# EAGLE design GYROSCOPIO-UPDATE (EAGLE 9.5.1)
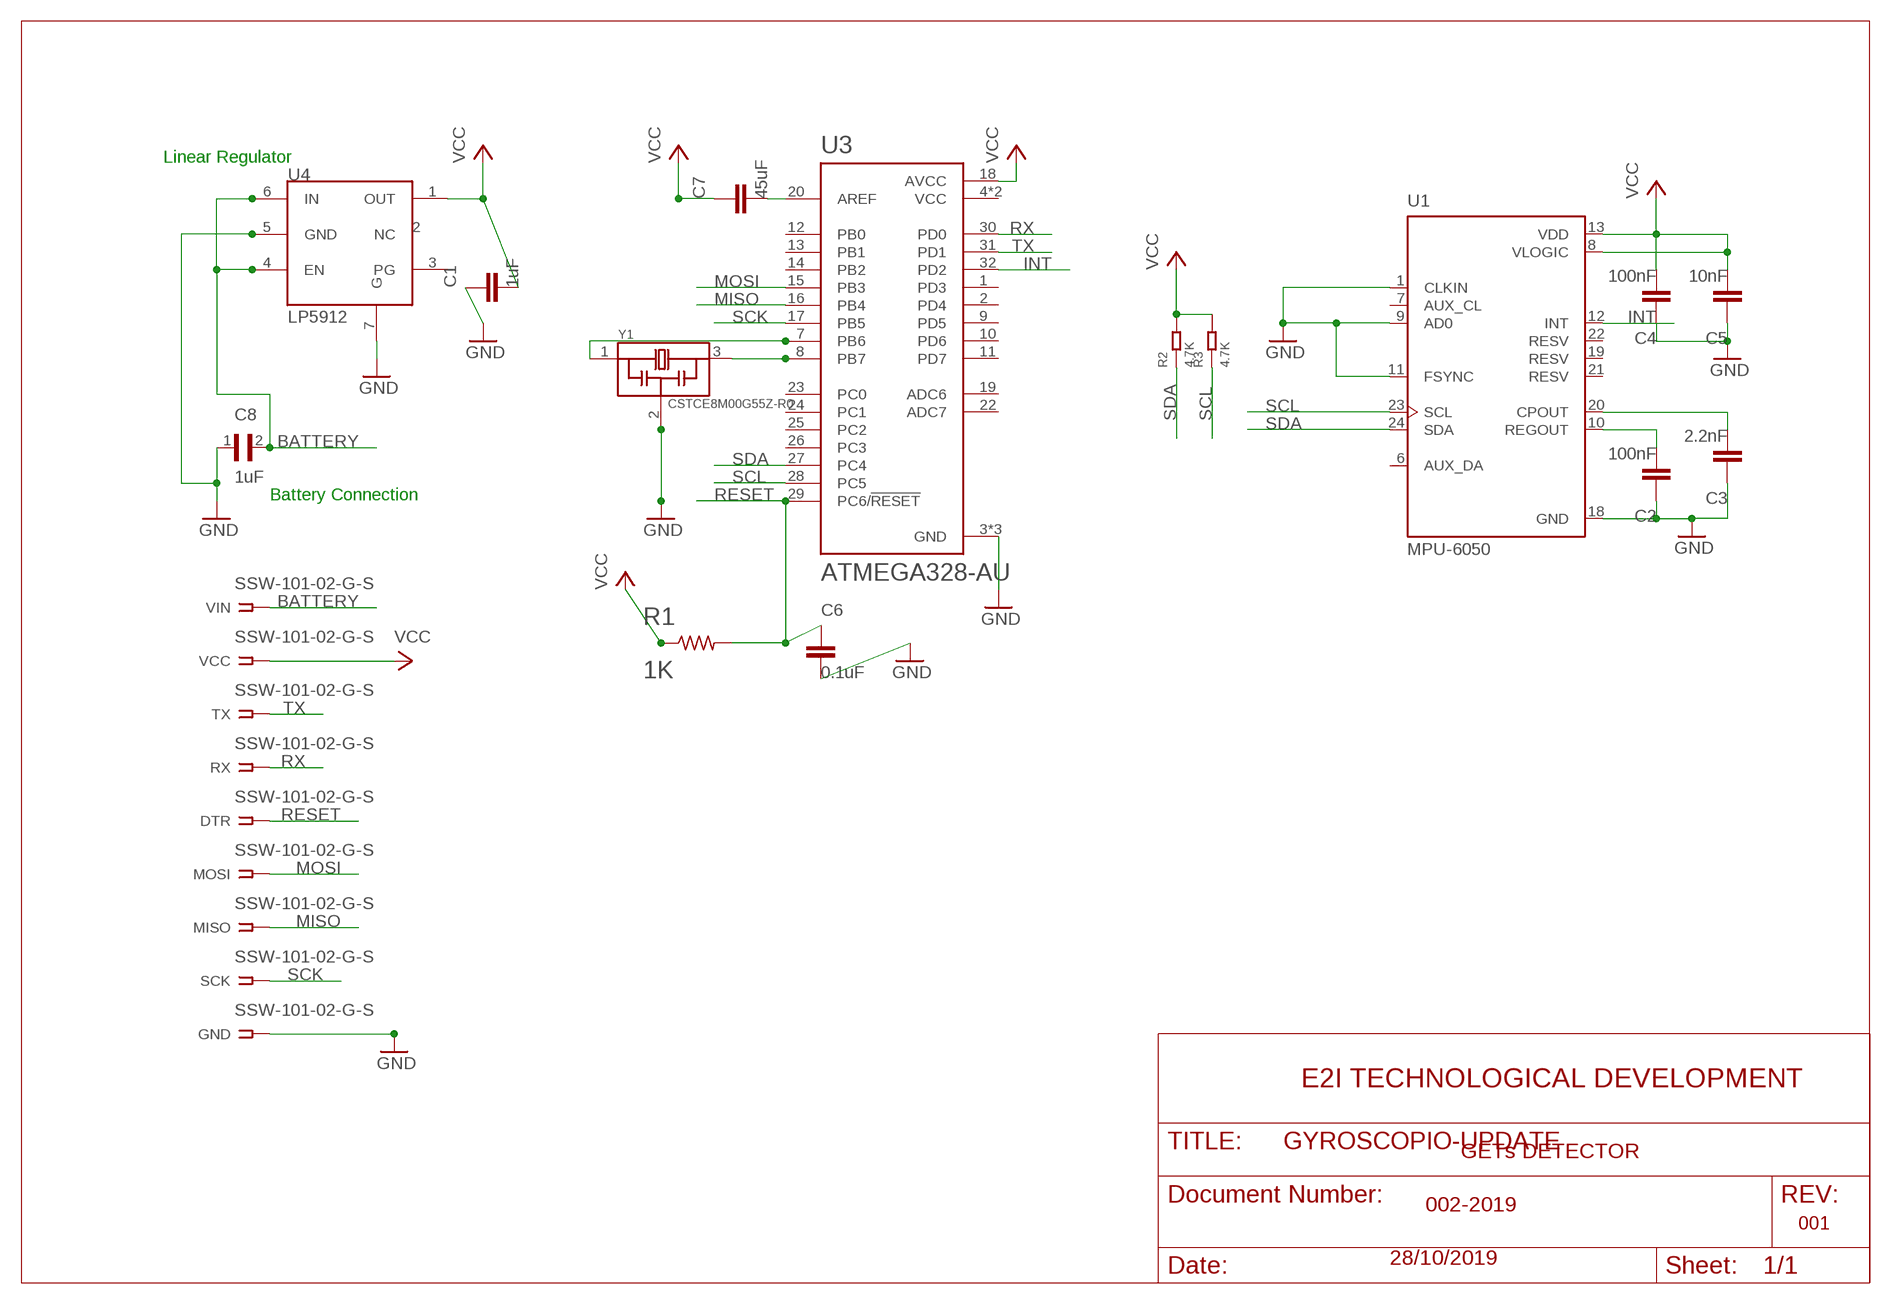
[diagram p0: schematic, sheet 1]

## Parts
C1  1uF  C-EUC0603  [C0603]
C2  100nF  C-EUC0603  [C0603]
C3  2.2nF  C-EUC0603  [C0603]
C4  100nF  C-EUC0603  [C0603]
C5  10nF  C-EUC0603  [C0603]
C6  0.1uF  C-EUC0603  [C0603]
C7  45uF  C-EUC0603  [C0603]
C8  1uF  0402YD105MAT2A  [CAPC1005X71N]
DTR  SSW-101-02-G-S  [SSW-101-02-G-S]
GND  SSW-101-02-G-S  [SSW-101-02-G-S]
MISO  SSW-101-02-G-S  [SSW-101-02-G-S]
MOSI  SSW-101-02-G-S  [SSW-101-02-G-S]
R1  1K  R-US_R0603  [R0603]
R2  4.7K  SMD-RES-4.7K-5%-1/16W(0402)  [R0402]
R3  4.7K  SMD-RES-4.7K-5%-1/16W(0402)  [R0402]
RX  SSW-101-02-G-S  [SSW-101-02-G-S]
SCK  SSW-101-02-G-S  [SSW-101-02-G-S]
TX  SSW-101-02-G-S  [SSW-101-02-G-S]
U1  MPU-6050  [QFN50P400X400X95-24N]
U3  ATMEGA328-AU  [QFP80P900X900X120-32N]
U4  LP5912  [LP5912]
VCC  SSW-101-02-G-S  [SSW-101-02-G-S]
VIN  SSW-101-02-G-S  [SSW-101-02-G-S]
Y1  CSTCE8M00G55Z-R0  CSTCE16M0V53-R0  [OSC_CSTCE16M0V53-R0]

## Nets
BATTERY: C8.2 U4.4(EN) U4.6(IN) VIN.1
GND: C1.1 C2.1 C3.1 C4.1 C5.1 C6.2 C8.1 GND.1 U1.1(CLKIN) U1.9(AD0) U1.11(FSYNC) U1.18(GND) U3.3(GND) U3.5(GND) U3.21(GND) U4.5(GND) U4.7(G) Y1.2
INT: U1.12(INT) U3.32(PD2)
MISO: MISO.1 U3.16(PB4)
MOSI: MOSI.1 U3.15(PB3)
N$1: U3.7(PB6) Y1.1
N$2: U3.8(PB7) Y1.3
N$3: C2.2 U1.10(REGOUT)
N$4: C3.2 U1.20(CPOUT)
N$11: C7.2 U3.20(AREF)
RESET: C6.1 DTR.1 R1.2 U3.29(PC6/!RESET)
RX: RX.1 U3.30(PD0)
SCK: SCK.1 U3.17(PB5)
SCL: R3.1 U1.23(SCL) U3.28(PC5)
SDA: R2.1 U1.24(SDA) U3.27(PC4)
TX: TX.1 U3.31(PD1)
VCC: C1.2 C4.2 C5.2 C7.1 R1.1 R2.2 R3.2 U1.8(VLOGIC) U1.13(VDD) U3.18(AVCC) U4.1(OUT) VCC.1
Unconnected: U1.6(AUX_DA) U1.7(AUX_CL) U1.19(RESV) U1.21(RESV) U1.22(RESV) U3.1(PD3) U3.2(PD4) U3.9(PD5) U3.10(PD6) U3.11(PD7) U3.12(PB0) U3.13(PB1) U3.14(PB2) U3.19(ADC6) U3.22(ADC7) U3.23(PC0) U3.24(PC1) U3.25(PC2) U3.26(PC3) U4.2(NC) U4.3(PG)

## Notes on the sheet
- Linear Regulator
- Battery Connection
- E2I TECHNOLOGICAL DEVELOPMENT
- GETs DETECTOR
- 002-2019
- 001
- 28/10/2019

## Power pins joined to a net without a drawn wire
VCC: U3.4(VCC) U3.6(VCC)

## Library data of the parts
C1-C7 = rcl:C-EU: CAPACITOR, European symbol; SPICEPREFIX: C
C8 = Capacitor1uF:0402YD105MAT2A: CAP 1UF 16VDC X5R 20% SMD 0402; AVAILABILITY: Unavailable; DESCRIPTION: Cap 1uf 16vdc X5r 20% Smd 0402; MF: AVX; MP: 0402YD105MAT2A; PACKAGE: 1005 AVX; PRICE: None
DTR GND MISO MOSI RX SCK TX VCC VIN = con-samtec:SSW-101-02-G-S: THROUGH-HOLE .025" SQ POST SOCKET Source: Samtec SSW.pdf; MF: Samtec Inc.; MPN: SSW-101-02-G-S; OC_FARNELL: unknown; OC_NEWARK: 11P9336
R1 = rcl:R-US_: RESISTOR, American symbol; SPICEPREFIX: R
R2 R3 = RES-4.7K-SMD-5_-1_16W_0402_:SMD-RES-4.7K-5%-1/16W(0402): 301010010; AVAILABILITY: Unavailable; DESCRIPTION: Res Thick Film 0402 4.7K Ohm 5% 0.063W_1/16W_ ?100ppm/C Molded SMD Paper T/R; MF: Yageo; MP: RC0402JR074K7L; PACKAGE: 0402 Yageo; PRICE: None
U1 = MPU-6050:MPU-6050: MPU-6050 Six-Axis (Gyro + Accelerometer) MEMS MotionTracking™ Devices; AVAILABILITY: Unavailable; DESCRIPTION: 3-axis gyroscope, 3-axis accelerometer in a 4x4x0.9 housing; MF: TDK InvenSense; MP: MPU-6050; PACKAGE: QFN-24 InvenSense; PRICE: None
U3 = ATMEGA328-AU:ATMEGA328-AU: ATmega Series 20 MHz 32 KB Flash 2 KB SRAM 8-Bit Microcontroller - TQFP-32; AVAILABILITY: Unavailable; DESCRIPTION: ATmega Series 20 MHz 32 KB Flash 2 KB SRAM 8-Bit Microcontroller - TQFP-32; MF: Microchip; MP: ATMEGA328-AU; PACKAGE: TQFP-32 Microchip; PRICE: None
U4 = electronic-labs:LP5912
Y1 = CSTCE16M0V53-R0:CSTCE16M0V53-R0: 16MHz Ceramic Resonator Built in Capacitor 15pF ±0.3% -20°C ~ 80°C Surface Mount; AVAILABILITY: Unavailable; DESCRIPTION: Ceramic Resonator 16MHz ??0.5% _Tol_ ??0.3% _Stability_ 15pF 40Ohm 3-Pin CSMD T/R; MF: Murata; MP: CSTCE16M0V53-R0; PACKAGE: SMD-3 Murata; PRICE: None

## Board
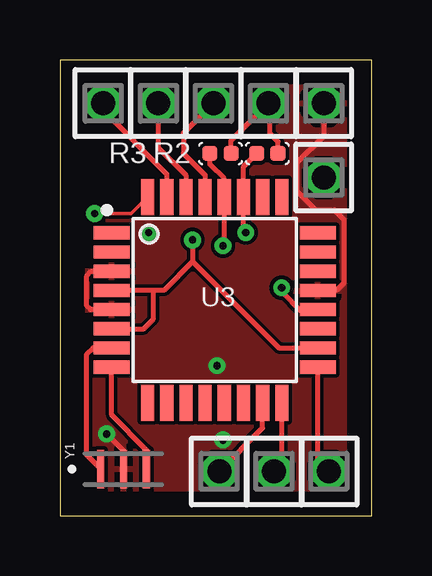
[diagram p1: board, top side]
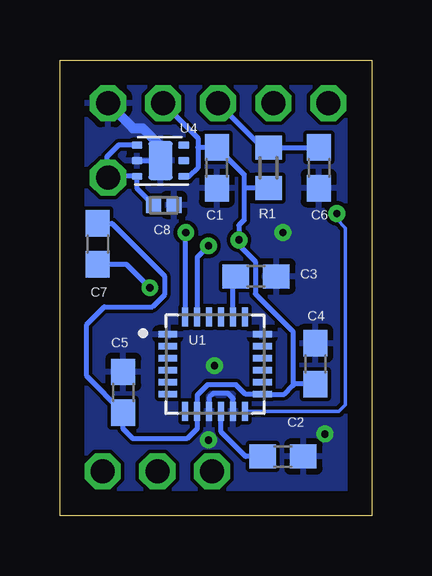
[diagram p2: board, bottom side, seen from below]

Size 13 x 19 mm. Coordinates in mm from the lower left corner, seen from the top.
Outline: 0,0 13,0 13,19 0,19 0,0
Copper layers (1*16): Top 0.035mm / dielectric 1.5mm / Bottom 0.035mm
Design rules "default *": minimum track width 6mil, minimum drill 0.3mm, track to track 6mil, track to pad 6mil, pad to pad 6mil, via to via 6mil, smd to smd 6mil, copper to edge 40mil, drill to drill 6mil, minimum pad ring 10mil, minimum via ring 8mil, stop-mask expansion 4mil, vias tented up to drill 0.5mm, thermal gap 10mil

### Footprints (pad centres in the part's own frame; a part is rotated, then mirrored left to right if it is on the bottom)
C0603 = smd 1.1 x 1: 1 -0.85,0; 2 0.85,0
CAPC1005X71N = smd 0.62 x 0.67: 1 -0.425,0; 2 0.425,0
SSW-101-02-G-S = drill 1 pad 1.5 octagon: 1 0,0
R0603 = smd 1 x 1.1: 1 -0.85,0; 2 0.85,0
R0402 = smd 0.635 x 0.635: 1 0,0.445; 2 0,-0.445
QFN50P400X400X95-24N = smd 0.79 x 0.26: 1 -1.97,1.25; 2 -1.97,0.75; 3 -1.97,0.25; 4 -1.97,-0.25; 5 -1.97,-0.75; 6 -1.97,-1.25; 13 1.97,-1.25; 14 1.97,-0.75; 15 1.97,-0.25; 16 1.97,0.25; 17 1.97,0.75; 18 1.97,1.25 | smd 0.26 x 0.79: 7 -1.25,-1.97; 8 -0.75,-1.97; 9 -0.25,-1.97; 10 0.25,-1.97; 11 0.75,-1.97; 12 1.25,-1.97; 19 1.25,1.97; 20 0.75,1.97; 21 0.25,1.97; 22 -0.25,1.97; 23 -0.75,1.97; 24 -1.25,1.97
QFP80P900X900X120-32N = smd 1.5 x 0.55: 1 -4.3,2.8; 2 -4.3,2; 3 -4.3,1.2; 4 -4.3,0.4; 5 -4.3,-0.4; 6 -4.3,-1.2; 7 -4.3,-2; 8 -4.3,-2.8; 17 4.3,-2.8; 18 4.3,-2; 19 4.3,-1.2; 20 4.3,-0.4; 21 4.3,0.4; 22 4.3,1.2; 23 4.3,2; 24 4.3,2.8 | smd 0.55 x 1.5: 9 -2.8,-4.3; 10 -2,-4.3; 11 -1.2,-4.3; 12 -0.4,-4.3; 13 0.4,-4.3; 14 1.2,-4.3; 15 2,-4.3; 16 2.8,-4.3; 25 2.8,4.3; 26 2,4.3; 27 1.2,4.3; 28 0.4,4.3; 29 -0.4,4.3; 30 -1.2,4.3; 31 -2,4.3; 32 -2.8,4.3
LP5912 = smd 0.45 x 0.3: 1 0,0.65; 2 0,0; 3 0,-0.65; 4 1.95,-0.65; 5 1.95,0; 6 1.95,0.65 | smd 1 x 1.6: 7 0.975,0
OSC_CSTCE16M0V53-R0 = smd 0.3 x 1.6: 1 -0.95,0; 2 0,0; 3 0.95,0

### Placement (x,y rotation side)
C1  6.45,14.5 90 bottom
C2  3.7,2.46 180 bottom
C3  4.82,9.98 180 bottom
C4  2.35,6.33 270 bottom
C5  10.36,5.14 270 bottom
C6  2.2,14.5 270 bottom
C7  11.42,11.33 270 bottom
C8  8.67,12.95 180 bottom
DTR  6.4,17.2 270 top
GND  11,17.2 270 top
MISO  8.94,1.84 90 top
MOSI  6.65,1.84 90 top
R1  4.3,14.5 90 bottom
R2  8.65,15.1 90 top
R3  6.7,15.1 90 top
RX  4.1,17.2 270 top
SCK  11.22,1.84 90 top
TX  1.8,17.2 270 top
U1  6.53,6.31 0 bottom
U3  6.46,8.99 0 top
U4  7.83,14.8 180 bottom
VCC  8.7,17.2 270 top
VIN  11,14.1 270 top
Y1  2.65,1.94 0 top

### Tracks (layer width: path | path; a pad name or v marks a point on that pad's centre or on a via)
BATTERY
  Bottom 0.2: U4.4 10.55,15.45 11.05,14.95 11.05,14.15 VIN.1 10.95,14.15 U4.6 9.78,13.63 C8.2
GND  (via drill 0.3)
  Top 0.2: Y1.2 2.65,2.7 v1.95,3.4 | U3.5 1.28,8.59 1.12,8.75 1.12,10 1.31,10.19 U3.3 | GND.1 11,15.82 9.89,14.72 9.89,13.53 10.68,12.74 11.46,12.74 11.85,12.35 11.85,9.7 11.54,9.39 U3.21
  Bottom 0.2: U4.5 U4.7 | U1.11 5.78,4.88 6,5.1 6.6,5.1 6.78,4.92 U1.9
  Bottom 0.406: GND.1 9.95,16.15 9.55,16.15 8.8,15.4 U4.7
  other vias: 6.55,6.25 3.7,11.8 6.8,3.15
  pour Bottom: 0.3,18.7 0.3,0.3 12.6,0.3 12.6,18.7
  pour Top: 0.05,18.85 12.9,18.85 12.9,0.1 0.05,0.1
INT  (via drill 0.3)
  Top 0.152: U3.32 2.97,12.6 v1.45,12.6
  Bottom 0.152: U1.12 1.36,4.34 1.09,4.61 1.09,12 1.45,12.36 v1.45,12.6
MISO
  Top 0.2: MISO.1 9.26,2.16 U3.16
MOSI
  Top 0.2: MOSI.1 8.46,3.65 U3.15
N$1
  Top 0.2: Y1.1 1.12,2.52 1.12,6.73 1.38,6.99 U3.7
N$2
  Top 0.2: Y1.3 3.6,2.75 2.16,4.19 U3.8
N$3
  Bottom 0.2: U1.10 6.28,3.48 5.26,2.46 C2.2
N$4
  Bottom 0.2: U1.20 5.78,9.98 C3.2
N$11  (via drill 0.3)
  Top 0.2: U3.20 10.67,8.5 10.1,8.5 9.25,9.35 v9.25,9.5
  Bottom 0.2: C7.2 10.23,10.48 v9.25,9.5
RESET
  Top 0.2: DTR.1 5.15,15.95 5.15,15.1 6.06,14.19 U3.29
  Bottom 0.2: C6.1 R1.2 4.43,15.23 DTR.1
RX
  Top 0.2: RX.1 4.1,15.35 5.26,14.19 U3.30
SCK
  Top 0.2: SCK.1 10.76,2.3 U3.17
SCL  (via drill 0.3)
  Top 0.2: v6.8,11.25 6.86,11.31 U3.28 6.86,14.04 6.25,14.64 R3.1
  Bottom 0.2: v6.8,11.25 7.28,10.77 U1.23
SDA  (via drill 0.3)
  Top 0.2: R2.1 7.66,14.55 U3.27 7.66,11.89 v7.75,11.8
  Bottom 0.2: v7.75,11.8 7.78,11.77 U1.24
TX
  Top 0.2: TX.1 1.8,16.9 4.46,14.24 U3.31
VCC  (via drill 0.3)
  Top 0.2: R3.2 7.14,15.64 VCC.1 8.74,17.16 8.74,15.95 9.1,15.6 R2.2 | v5.54,11.5 5.54,10.59 | 3.85,9.39 4.34,9.39 5.54,10.59 | 3.85,9.39 U3.4 | U3.6 3.49,7.79 3.9,8.2 3.9,9.34 3.85,9.39 | 5.54,10.59 9.13,6.99 U3.18
  Bottom 0.2: VCC.1 7.25,15.75 7.25,15.35 | 7.25,15.35 7.25,14.5 7.6,14.15 U4.1 | C4.2 3.22,5.48 3.27,5.42 | 3.27,5.42 3.64,5.06 U1.13 5.26,5.06 5.65,5.45 6.85,5.45 7.28,5.02 U1.8 7.28,3.62 7.7,3.2 9.95,3.2 10.36,3.61 C5.2 11.88,5.81 11.88,7.97 11.15,8.7 9.14,8.7 8.64,9.2 8.64,9.99 10.83,12.18 C7.1 | 7.25,15.35 C1.2 5.32,14.22 5.32,13.65 | 3.27,5.42 3.27,7.67 4.85,9.25 4.85,10.6 5.54,11.29 v5.54,11.5 5.54,12.11 5.32,12.32 5.32,13.65 | R1.1 5.32,13.65

### Text on the board
bNames: U4